# EAGLE design Irrigation Controller (EAGLE 9.5.1)
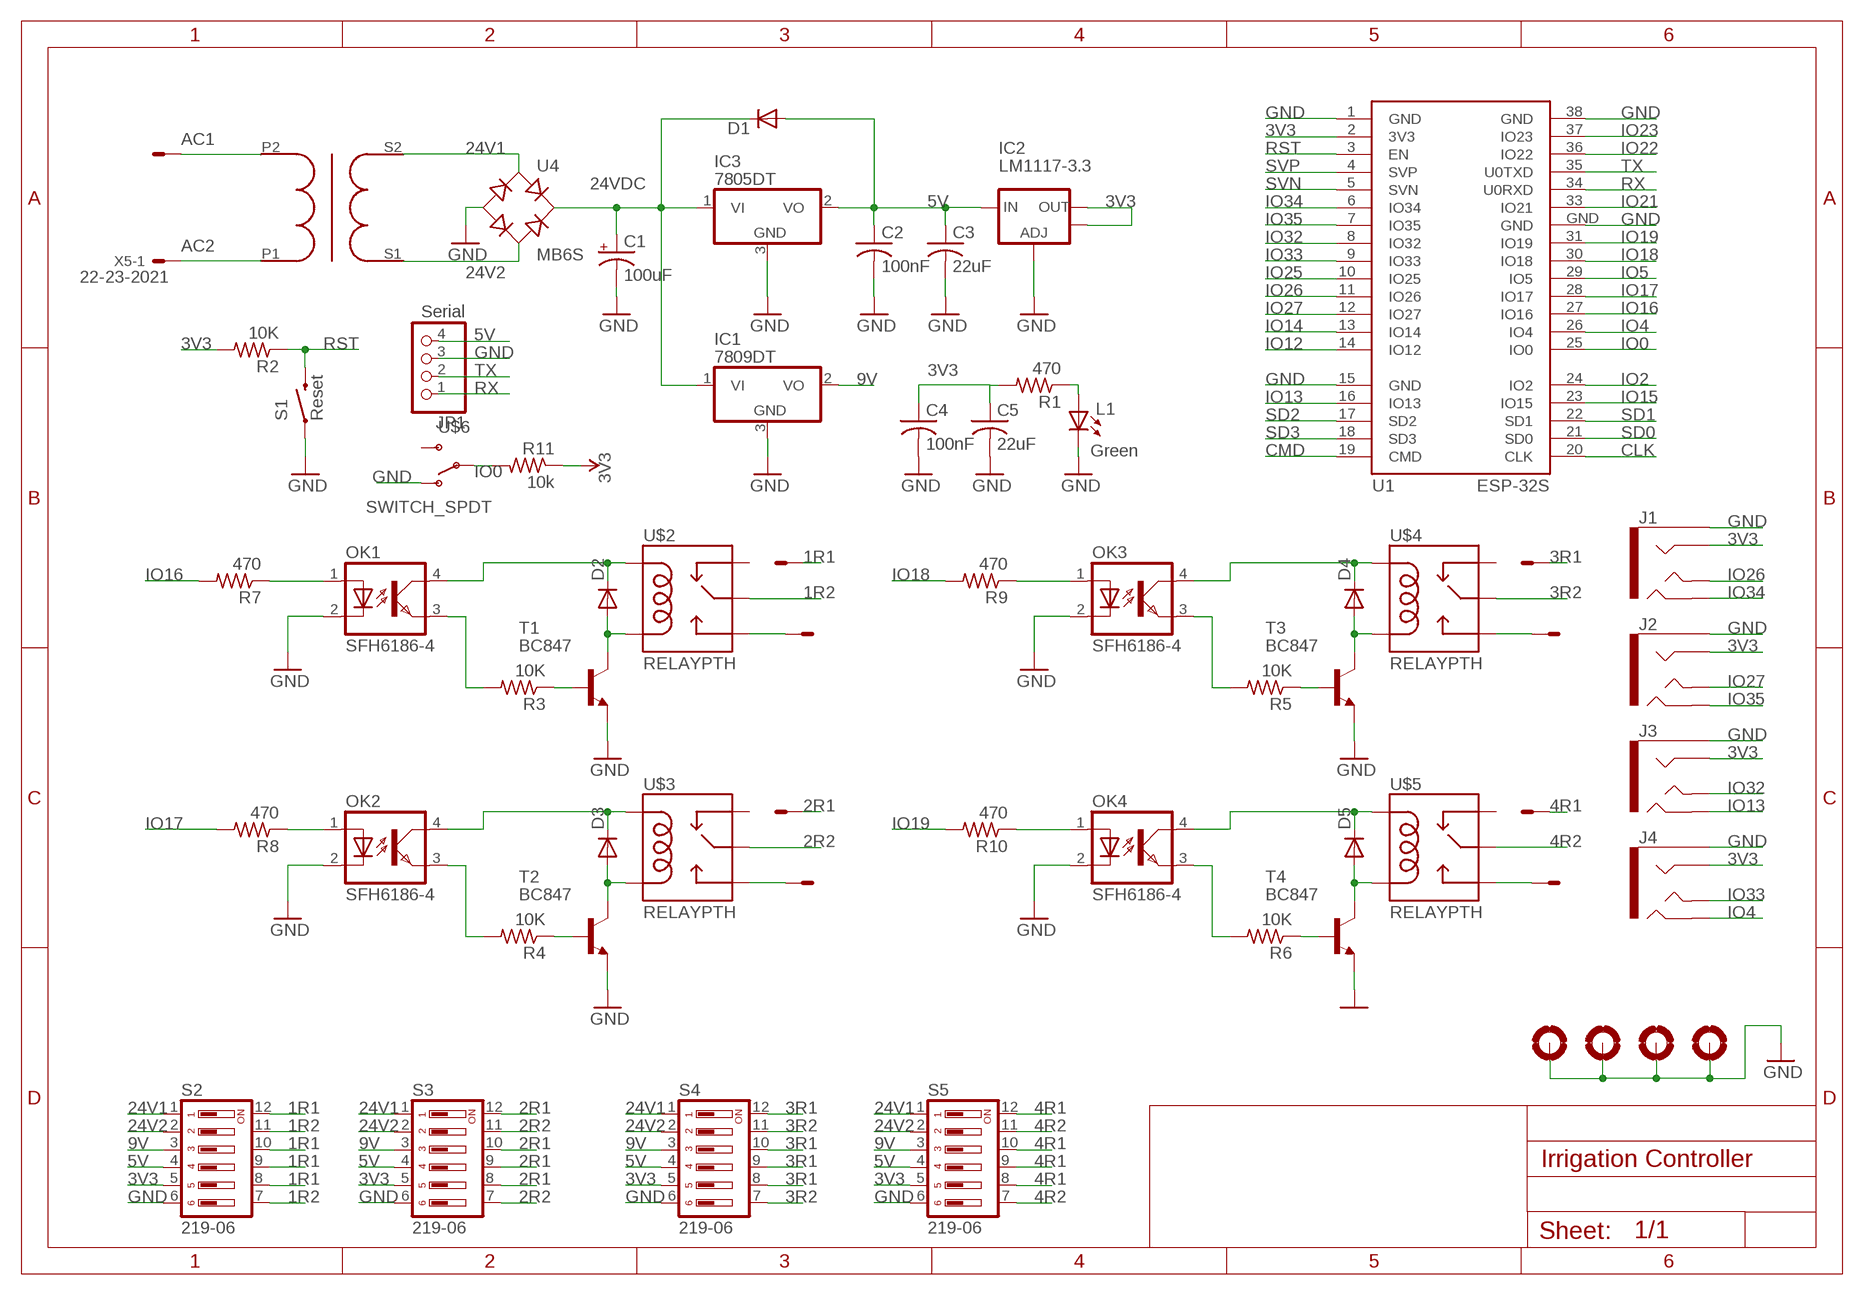
[diagram p0: schematic, sheet 1]

## Parts
C1  100uF  CPOL-USCT7343  [CT7343]
C2  100nF  C1206  [1206]
C3  22uF  C1206  [1206]
C4  100nF  C1206  [1206]
C5  22uF  C1206  [1206]
D1  DIODE-SOD123  [SOD123]
D2  DIODE-SOD123  [SOD123]
D3  DIODE-SOD123  [SOD123]
D4  DIODE-SOD123  [SOD123]
D5  DIODE-SOD123  [SOD123]
H1  MOUNT-PAD-ROUND3.0  [3,0-PAD]
H2  MOUNT-PAD-ROUND3.0  [3,0-PAD]
H3  MOUNT-PAD-ROUND3.0  [3,0-PAD]
H4  MOUNT-PAD-ROUND3.0  [3,0-PAD]
IC1  7809DT  7805DT  [TO252]
IC2  LM1117-3.3  V_REG_LM1117SOT223  [SOT223]
IC3  7805DT  [TO252]
J1  AUDIO_JACK_TRRSSMD_RA  [AUDIO_JACK_3.5MM_TRRS_SMD_RA]
J2  AUDIO_JACK_TRRSSMD_RA  [AUDIO_JACK_3.5MM_TRRS_SMD_RA]
J3  AUDIO_JACK_TRRSSMD_RA  [AUDIO_JACK_3.5MM_TRRS_SMD_RA]
J4  AUDIO_JACK_TRRSSMD_RA  [AUDIO_JACK_3.5MM_TRRS_SMD_RA]
JP1  Serial  PINHD-1X4  [1X04]
L1  Green  LED1206  [LED1206]
OK1  SFH6186-4  [SMD4-7]
OK2  SFH6186-4  [SMD4-7]
OK3  SFH6186-4  [SMD4-7]
OK4  SFH6186-4  [SMD4-7]
R1  470  R1206  [1206]
R2  10K  R-US_R1206  [R1206]
R3  10K  R-US_R1206  [R1206]
R4  10K  R-US_R1206  [R1206]
R5  10K  R-US_R1206  [R1206]
R6  10K  R-US_R1206  [R1206]
R7  470  R-US_R1206  [R1206]
R8  470  R-US_R1206  [R1206]
R9  470  R-US_R1206  [R1206]
R10  470  R-US_R1206  [R1206]
R11  10k  R1206  [1206]
S1  Reset  SWITCH-MOMENTARY-2SMD-4  [TACTILE_SWITCH_TALL]
S2  219-06  [CTS-219-06]
S3  219-06  [CTS-219-06]
S4  219-06  [CTS-219-06]
S5  219-06  [CTS-219-06]
T1  BC847  [SOT23]
T2  BC847  [SOT23]
T3  BC847  [SOT23]
T4  BC847  [SOT23]
U1  ESP-32S  [ESP-32S]
U4  MB6S  [SOIC-4]
U$1  TRANSFORMADOR_PE3010-M  [TRANSFORMADOR_PE3010-M]
U$2  RELAYPTH  [SRD-05VDC-SL-C]
U$3  RELAYPTH  [SRD-05VDC-SL-C]
U$4  RELAYPTH  [SRD-05VDC-SL-C]
U$5  RELAYPTH  [SRD-05VDC-SL-C]
U$6  SWITCH_SPDT  [KPS-1290]
X1  22-23-2021  [22-23-2021]
X2  22-23-2021  [22-23-2021]
X3  22-23-2021  [22-23-2021]
X4  22-23-2021  [22-23-2021]
X5  22-23-2021  [22-23-2021]

## Nets
1R1: S2.8 S2.9 S2.10 S2.12 X1.1
1R2: S2.7 S2.11 U$2.SWCOMMON
2R1: S3.8 S3.9 S3.10 S3.12 X2.1
2R2: S3.7 S3.11 U$3.SWCOMMON
3R1: S4.8 S4.9 S4.10 S4.12 X3.1
3R2: S4.7 S4.11 U$4.SWCOMMON
3V3: C4.1 C5.1 IC2.2(OUT) IC2.4(OUT) J1.RING1 J2.RING1 J3.RING1 J4.RING1 R1.2 R2.2 R11.1 S2.5 S3.5 S4.5 S5.5 U1.2(3V3) ; supply symbol labelled VCC
4R1: S5.8 S5.9 S5.10 S5.12 X4.1
4R2: S5.7 S5.11 U$5.SWCOMMON
5V: C2.1 C3.1 D1.A IC2.3(IN) IC3.2(VO) JP1.4 S2.4 S3.4 S4.4 S5.4
9V: IC1.2(VO) S2.3 S3.3 S4.3 S5.3
24V1: S2.1 S3.1 S4.1 S5.1 U4.~1(AC1) U$1.S2
24V2: S2.2 S3.2 S4.2 S5.2 U4.~2(AC2) U$1.S1
24VDC: C1.+ D1.C IC1.1(VI) IC3.1(VI) U4.+
AC1: U$1.P2 X5.2
AC2: U$1.P1 X5.1
CLK: U1.20(CLK)
CMD: U1.19(CMD)
GND: C1.- C2.2 C3.2 C4.2 C5.2 H1.B3,0(MOUNT) H2.B3,0(MOUNT) H3.B3,0(MOUNT) H4.B3,0(MOUNT) IC1.3(GND) IC2.1(ADJ) IC3.3(GND) J1.EARTH J2.EARTH J3.EARTH J4.EARTH JP1.3 L1.C OK1.2(C) OK2.2(C) OK3.2(C) OK4.2(C) S1.A2 S2.6 S3.6 S4.6 S5.6 T1.2(E) T2.2(E) T3.2(E) T4.2(E) U1.1(GND) U1.15(GND) U1.38(GND) U1.GND U4.- U$6.O
IO0: R11.2 U1.25(IO0) U$6.P
IO2: U1.24(IO2)
IO4: J4.RING2 U1.26(IO4)
IO5: U1.29(IO5)
IO12: U1.14(IO12)
IO13: J3.RING2 U1.16(IO13)
IO14: U1.13(IO14)
IO15: U1.23(IO15)
IO16: R7.2 U1.27(IO16)
IO17: R8.2 U1.28(IO17)
IO18: R9.2 U1.30(IO18)
IO19: R10.2 U1.31(IO19)
IO21: U1.33(IO21)
IO22: U1.36(IO22)
IO23: U1.37(IO23)
IO25: U1.10(IO25)
IO26: J1.TIP U1.11(IO26)
IO27: J2.TIP U1.12(IO27)
IO32: J3.TIP U1.8(IO32)
IO33: J4.TIP U1.9(IO33)
IO34: J1.RING2 U1.6(IO34)
IO35: J2.RING2 U1.7(IO35)
N$1: U$5.SWOPEN X4.2
N$2: U$4.SWOPEN X3.2
N$3: L1.A R1.1
N$4: U$3.SWOPEN X2.2
N$5: U$2.SWOPEN X1.2
N$6: D2.C OK1.4(COL) U$2.COIL1
N$7: D2.A T1.3(C) U$2.COIL0
N$8: OK1.3(EMIT) R3.2
N$9: R3.1 T1.1(B)
N$10: D3.C OK2.4(COL) U$3.COIL1
N$11: D3.A T2.3(C) U$3.COIL0
N$12: OK2.3(EMIT) R4.2
N$13: R4.1 T2.1(B)
N$14: D4.C OK3.4(COL) U$4.COIL1
N$15: D4.A T3.3(C) U$4.COIL0
N$16: OK3.3(EMIT) R5.2
N$17: R5.1 T3.1(B)
N$18: D5.C OK4.4(COL) U$5.COIL1
N$19: D5.A T4.3(C) U$5.COIL0
N$20: OK4.3(EMIT) R6.2
N$21: R6.1 T4.1(B)
N$22: OK1.1(A) R7.1
N$25: OK2.1(A) R8.1
N$27: OK3.1(A) R9.1
N$29: OK4.1(A) R10.1
RST: R2.1 S1.B2 U1.3(EN)
RX: JP1.1 U1.34(U0RXD)
SD0: U1.21(SD0)
SD1: U1.22(SD1)
SD2: U1.17(SD2)
SD3: U1.18(SD3)
SVN: U1.5(SVN)
SVP: U1.4(SVP)
TX: JP1.2 U1.35(U0TXD)
Unconnected: U$2.SWCLOSED(SWCLOSE) U$3.SWCLOSED(SWCLOSE) U$4.SWCLOSED(SWCLOSE) U$5.SWCLOSED(SWCLOSE) U$6.S

## Library data of the parts
C1 = resistor:CPOL-US: POLARIZED CAPACITOR, American symbol
C2-C5 = SpaceDIY_passive_components:C1206
D1-D5 = diode:DIODE-: DIODE
H1-H4 = holes:MOUNT-PAD-ROUND: MOUNTING PAD, round
IC1 IC3 = linear:78*: Positive VOLTAGE REGULATOR Source: http://cache.national.com/ds/LM/LM78L05.pdf http://www.fairchildsemi.com/ds/LM/LM7805.pdf
IC2 = SparkFun:V_REG_LM1117: Voltage Regulator LM1117 Standard adjustable voltage regulator but in SMD form. Spark Fun Electronics SKU : COM-00595
J1-J4 = SparkFun-Connectors:AUDIO_JACK_TRRS: Audio Jack - 3.5mm TRRS (SMD) This is a 3.5mm TRRS SMD audio jack. TRRS connectors are the audio-style connectors that you see on some phones, MP3 players and development boards. TRRS stands for “tip, ring, ring, sleeve,” which reflects that this has three conductors and a ground. SparkFun Products: Audio Jack <https://www.sparkfun.com/products/12639> mbed Starter Kit <https://www.sparkfun.com/products/12968> SparkFun TRRS 3.5mm Jack Breakout <https://www.sparkfun.com/products/11570>; PROD_ID: CONN-10676; SF_ID: PRT-12639
JP1 = SpaceDIY_connectors:PINHD-1X4: PIN HEADER
L1 = SpaceDIY_passive_components:LED1206
OK1-OK4 = optocoupler:SFH618?*: Optocoupler, Phototransistor Output, Low Input Current Source: Data sheet <http://www.vishay.com/docs/83673/sfh618.pdf>; MF: VISHAY/TELEFUNKEN; MPN: SFH6186-4; OC_FARNELL: 1469530; OC_NEWARK: 21H7753
R1 R11 = SpaceDIY_passive_components:R1206
R2-R10 = resistor:R-US_: RESISTOR, American symbol
S1 = Testing:SWITCH-MOMENTARY-2: Various NO switches- pushbuttons, reed, etc
S2-S5 = switch-dil:219-06*: Surface Mount DIP Switch Series 219 SMT CTS Electronic Components Sourc: www.ctscorp.com; OC_FARNELL: unknown; OC_NEWARK: unknown
T1-T4 = transistor:BC847: NPN TRANSISTOR
U1 = esp32:ESP-32S: Ai-Thinker ESP-32S
U4 = rectifier:MB*S: Bridge Rectifier Source: http://www.fairchildsemi.com/ds/MB/MB6S.pdf
U$1 = SpaceDIY_special_components:TRANSFORMADOR_PE3010-M
U$2-U$5 = SpaceDIY_actuators:RELAY: SPDT relay (COM-00101)
U$6 = SparkFun-Retired:SWITCH_SPDT: SWCH-10651 Side-actuated SPDT slide switch, as used on the Arduino Pro; PROD_ID: SWCH-10651
X1-X5 = con-molex:22-23-2021: .100" (2.54mm) Center Header - 2 Pin; MF: MOLEX; MPN: 22-23-2021; OC_FARNELL: 1462926; OC_NEWARK: 25C3832

## Board
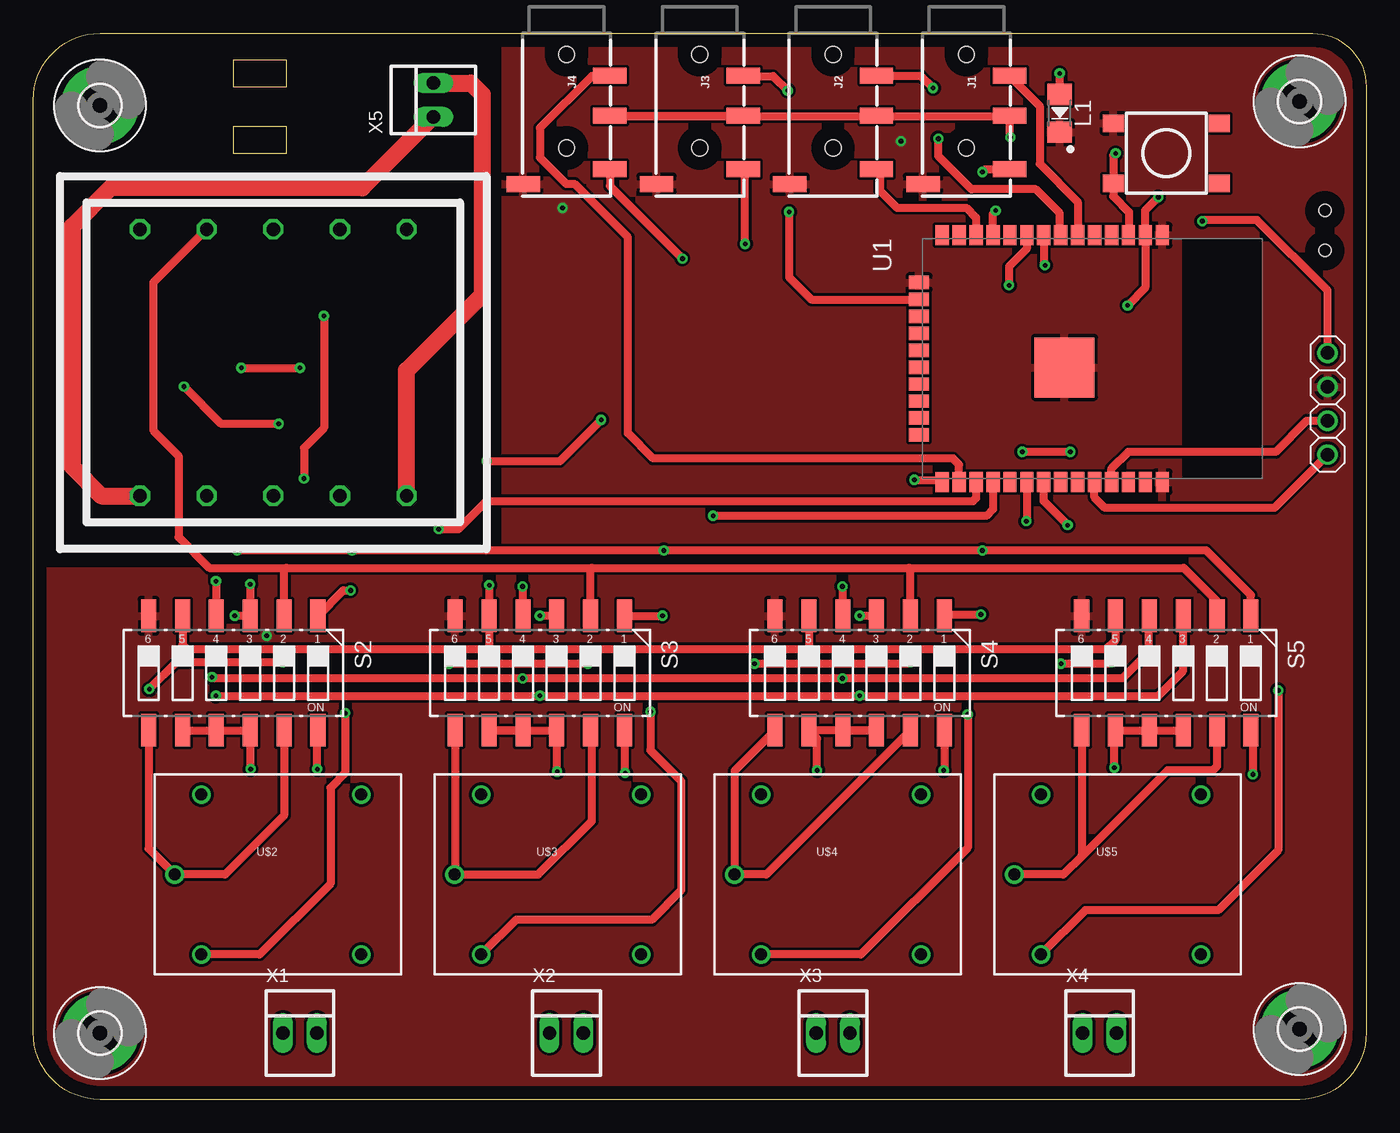
[diagram p1: board, top side]
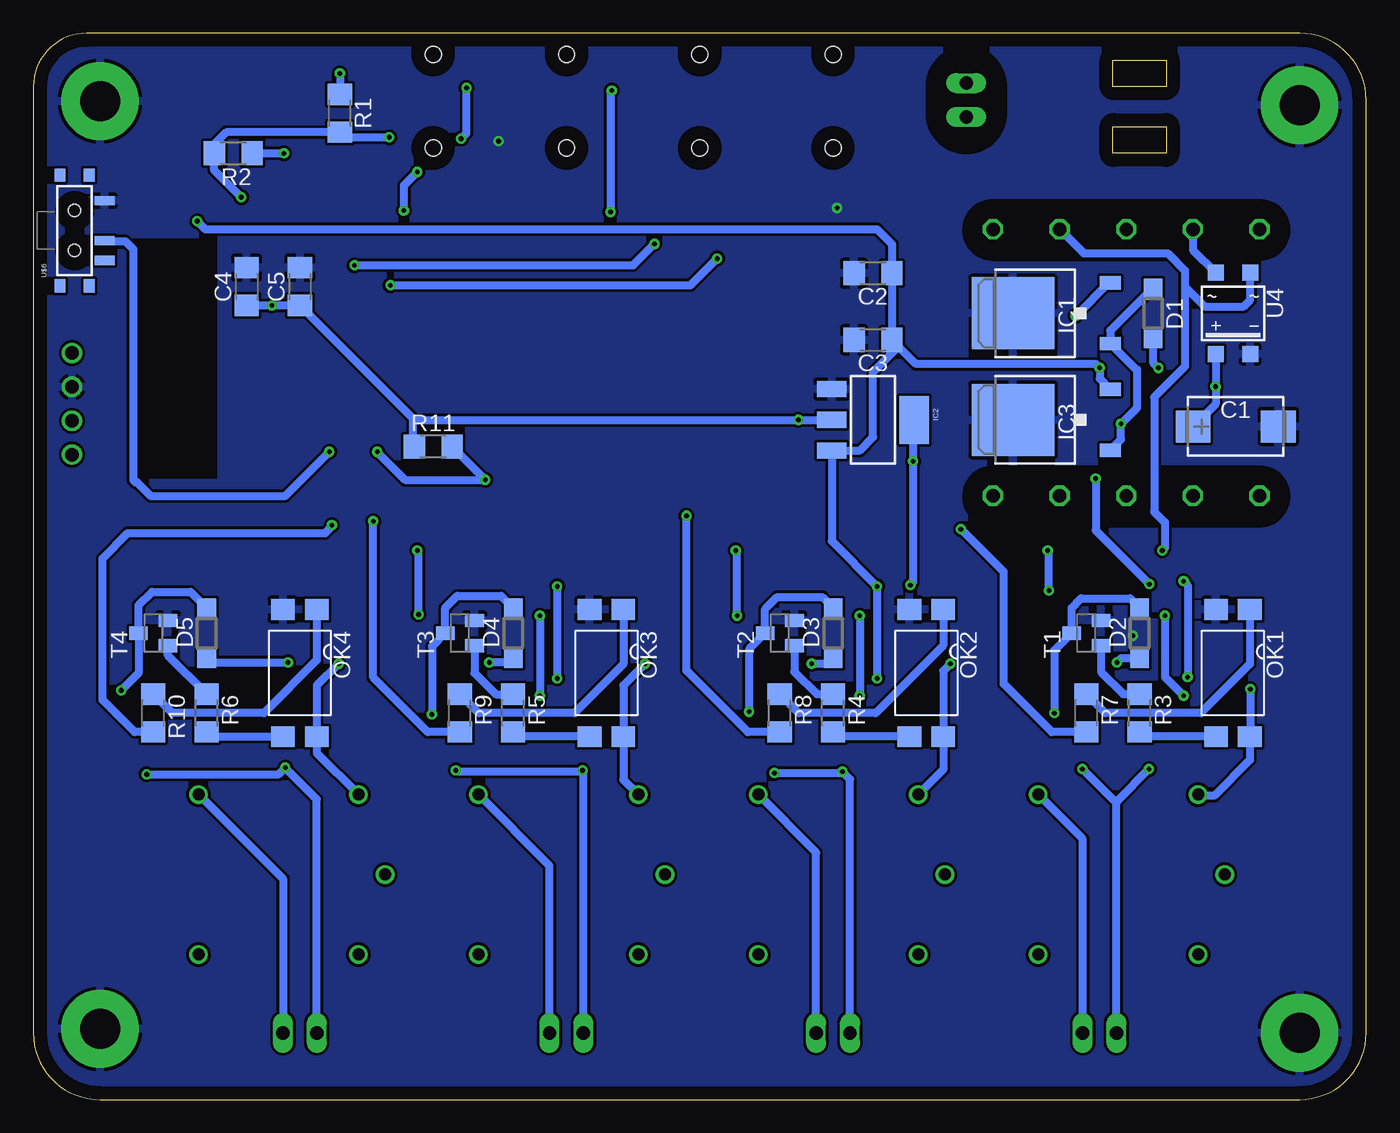
[diagram p2: board, bottom side, seen from below]

Size 100 x 80 mm. Coordinates in mm from the lower left corner, seen from the top.
Outline: 0,5 0,75 arc-90 5,80 96,80 arc-90 100,76 100,5 arc-90 95,0 5,0 arc-90 0,5
Outline: 19,78 15,78 15,76 19,76 19,78
Outline: 15,73 15,71 19,71 19,73 15,73
Copper layers (1*16): Top 0.035mm / dielectric 1.5mm / Bottom 0.035mm
Design rules "PCBway": minimum track width 6mil, minimum drill 0.3mm, track to track 0.205mm, track to pad 0.205mm, pad to pad 0.205mm, via to via 0.205mm, smd to smd 8mil, copper to edge 40mil, drill to drill 8mil, minimum pad ring 10mil, minimum via ring 8mil, stop-mask expansion 4mil, vias tented up to drill 25mil, thermal gap 10mil
tRestrict: area 0,40 to 35,80
bRestrict: area 27,71 to 33,79; area 5.8,63 to 30.2,67.5; area 5.8,43 to 30.2,47.5

### Footprints (pad centres in the part's own frame; a part is rotated, then mirrored left to right if it is on the bottom)
CT7343 = smd 2.6 x 2.4: + 3.2,0; - -3.2,0
1206 = smd 1.6 x 1.803: 1 -1.422,0; 2 1.422,0
SOD123 = smd 1.4 x 1.4: A 1.9,0; C -1.9,0
3,0-PAD = drill 3 pad 5.842: B3,0 0,0
TO252 = smd 1 x 1.6: 1 -2.28,-4.8; 2 2.28,-4.8 | smd 5.4 x 6.2: 3 0,2.5
SOT223 = smd 1.219 x 2.235: 1 -2.311,-3.099; 2 0,-3.099; 3 2.311,-3.099 | smd 3.6 x 2.2: 4 0,3.099
AUDIO_JACK_3.5MM_TRRS_SMD_RA = smd 1.2 x 2.5: EARTH 11.3,-3.25; RING1 6.2,3.25; RING2 3.2,3.25; TIP 10.2,3.25 | hole 1.2: 1.6,0; 8.6,0
1X04 = drill 1.016: 1 -3.81,0; 2 -1.27,0; 3 1.27,0; 4 3.81,0
LED1206 = smd 1.6 x 1.803: A -1.422,0; C 1.422,0
SMD4-7 = smd 1.78 x 1.55: 1 -1.27,-4.77; 2 1.27,-4.77; 3 1.27,4.77; 4 -1.27,4.77
R1206 = smd 1.6 x 1.803: 1 -1.422,0; 2 1.422,0
TACTILE_SWITCH_TALL = smd 1.55 x 1.3: A1 -3.975,-2.25; A2 3.975,-2.25; B1 -3.975,2.25; B2 3.975,2.25
CTS-219-06 = smd 1.13 x 2.44: 1 -6.35,-4.3; 2 -3.81,-4.3; 3 -1.27,-4.3; 4 1.27,-4.3; 5 3.81,-4.3; 6 6.35,-4.3; 7 6.35,4.3; 8 3.81,4.3; 9 1.27,4.3; 10 -1.27,4.3; 11 -3.81,4.3; 12 -6.35,4.3
SOT23 = smd 1 x 1.4: 1 -0.95,-1.1; 2 0.95,-1.1; 3 0,1.1
ESP-32S = smd 1.5 x 1: 1 -9.25,7; 2 -9.25,5.73; 3 -9.25,4.46; 4 -9.25,3.19; 5 -9.25,1.92; 6 -9.25,0.65; 7 -9.25,-0.62; 8 -9.25,-1.89; 9 -9.25,-3.16; 10 -9.25,-4.43; 11 -9.25,-5.7; 12 -9.25,-6.97; 13 -9.25,-8.24; 14 -9.25,-9.51; 25 9.25,-9.51; 26 9.25,-8.24; 27 9.25,-6.97; 28 9.25,-5.7; 29 9.25,-4.43; 30 9.25,-3.16; 31 9.25,-1.89; 32 9.25,-0.62; 33 9.25,0.65; 34 9.25,1.92; 35 9.25,3.19; 36 9.25,4.46; 37 9.25,5.73; 38 9.25,7 | smd 1 x 1.5: 15 -5.7,-11.25; 16 -4.43,-11.25; 17 -3.16,-11.25; 18 -1.89,-11.25; 19 -0.62,-11.25; 20 0.65,-11.25; 21 1.92,-11.25; 22 3.19,-11.25; 23 4.46,-11.25; 24 5.73,-11.25 | smd 4.5 x 4.5: GND 0.68,-0.33
SOIC-4 = smd 1.2 x 1.2: + 1.3,3.05; - -1.3,3.05; ~1 -1.3,-3.05; ~2 1.3,-3.05
TRANSFORMADOR_PE3010-M = drill 1 octagon: P1 -10,-10; P2 10,-10; P$3 10,10; P$6 -10,10; P$7 0,10; P$8 -5,-10; P$9 0,-10; P$10 5,-10; S1 -5,10; S2 5,10
SRD-05VDC-SL-C = drill 0.9: COIL0 -5.39,-6.12; COIL1 -5.39,5.88; SWCLOSED 6.61,-6.12; SWCOMMON -7.39,-0.12; SWOPEN 6.61,5.88
KPS-1290 = smd 0.7 x 1.5: O -2.25,2.25; P 0.75,2.25; S 2.25,2.25 | smd 1 x 0.8: P$1 -4.15,1.1; P$2 -4.15,-1.1; P$3 4.15,-1.1; P$4 4.15,1.1 | hole 0.9: -1.5,0; 1.5,0
22-23-2021 = drill 1 long: 1 -1.27,0; 2 1.27,0

### Placement (x,y rotation side)
C1  9.8,50.5 180 bottom
C2  37,62 180 bottom
C3  37,57 180 bottom
C4  84,61 90 bottom
C5  80,61 90 bottom
D1  16,59 270 bottom
D2  17,35 90 bottom
D3  40,35 90 bottom
D4  64,35 90 bottom
D5  87,35 90 bottom
H1  5,5 0 top
H2  95,5.3 0 top
H3  5,74.6 0 top
H4  95,74.9 0 top
IC1  24,59 90 bottom
IC2  37,51 270 bottom
IC3  24,51 90 bottom
J1  70,80 270 top
J2  60,80 270 top
J3  50,80 270 top
J4  40,80 270 top
JP1  97.1,52.2 90 top
L1  77,74 270 top
OK1  10,32 180 bottom
OK2  33,32 180 bottom
OK3  57,32 180 bottom
OK4  80,32 180 bottom
R1  77,74 270 bottom
R2  85,71 180 bottom
R3  17,29 270 bottom
R4  40,29 270 bottom
R5  64,29 270 bottom
R6  87,29 270 bottom
R7  21,29 270 bottom
R8  44,29 270 bottom
R9  68,29 270 bottom
R10  91,29 270 bottom
R11  70,49 0 bottom
S1  85,71 180 top
S2  15,32 180 top
S3  38,32 180 top
S4  62,32 180 top
S5  85,32 180 top
T1  21,35 90 bottom
T2  44,35 90 bottom
T3  68,35 90 bottom
T4  91,35 90 bottom
U1  77.7,55.6 270 top
U4  10,59 180 bottom
U$1  18,55.3 0 top
U$2  18,17 0 top
U$3  39,17 0 top
U$4  60,17 0 top
U$5  81,17 0 top
U$6  96.9,65.2 270 bottom
X1  20,5 0 top
X2  40,5 0 top
X3  60,5 0 top
X4  80,5 0 top
X5  30,75 90 top

### Tracks (layer width: path | path; a pad name or v marks a point on that pad's centre or on a via)
1R1  (via drill 0.35)
  Top 0.61: S2.8 S2.9 S2.10 16.27,24.83 v16.3,24.8 | v21.3,24.8 21.3,27.65 S2.12
  Bottom 0.61: X1.1 18.73,22.23 18.95,22.45 | 18.95,22.45 v21.3,24.8 | v16.3,24.8 18.65,22.45 18.95,22.45
1R2
  Top 0.61: S2.7 8.65,18.84 U$2.SWCOMMON 14.38,16.88 18.81,21.31 S2.11
2R1  (via drill 0.35)
  Top 0.61: v39.3,24.6 39.3,27.67 S3.10 S3.8 S3.9 | S3.12 44.35,24.55 v44.4,24.5
  Bottom 0.61: X2.1 38.73,24.03 v39.3,24.6 39.4,24.5 v44.4,24.5
2R2
  Top 0.61: S3.7 31.65,16.92 U$3.SWCOMMON 37.88,16.88 41.9,20.9 41.9,27.61 S3.11
3R1  (via drill 0.35)
  Top 0.61: v58.8,24.7 58.8,27.09 S4.8 S4.10 S4.9 | S4.12 68.35,24.75 v68.3,24.7
  Bottom 0.61: X3.1 58.73,24.63 | 58.73,24.63 v58.8,24.7 | v68.3,24.7 68.23,24.63 58.73,24.63
3R2
  Top 0.61: S4.11 54.99,16.88 U$4.SWCOMMON 52.61,24.66 S4.7
3V3  (via drill 0.35)
  Top 0.61: v34,47.9 39.5,47.9 v42.6,51 | v82.1,59.58 83.43,60.91 U1.2 83.43,66.73 v84.4,67.7 | v73.3,72.2 73.25,72.25 73.25,73.7 | 73.25,73.7 J1.RING1 | 73.25,73.7 73.15,73.8 J2.RING1 J4.RING1 J3.RING1 | S2.5 11.19,34.11 11.5,33.8 34.2,33.8 | 34.2,33.8 58.3,33.8 | 58.3,33.8 80.5,33.8 81.2,34.5 S5.5 | S4.5 58.19,33.91 58.3,33.8 | 34.2,33.8 34.19,33.81 S3.5 v34.2,38.6
  Bottom 0.61: IC2.4 34,50.9 v34,47.9 34,38.8 v34.2,38.6 | IC2.2 v42.6,51 71.5,51 | R11.1 71.5,49.08 71.5,51 | C4.1 v82.1,59.58 C5.1 71.5,51.08 71.5,51 | v84.4,67.7 86.42,69.72 R2.2 86.42,71.68 85.52,72.58 R1.2 76.62,72.2 v73.3,72.2
4R1  (via drill 0.35)
  Top 0.61: v81.1,24.9 81.1,27.61 S5.8 S5.10 S5.9 | S5.12 91.5,27.55 v91.5,24.4
  Bottom 0.61: X4.1 78.73,22.53 v81.1,24.9 81.6,24.4 v91.5,24.4
4R2
  Top 0.61: S5.11 88.81,25.01 88.5,24.7 85.1,24.7 78.7,18.3 | 78.7,18.3 77.28,16.88 U$5.SWCOMMON | S5.7 78.65,18.35 78.7,18.3
5V  (via drill 0.35)
  Top 0.61: v15.6,54.9 v20,54.9 | JP1.4 97.1,60.7 91.8,66 87.8,66 v87.7,65.9 | S3.4 36.73,38.47 v36.7,38.5 | v13.4,31.7 13.5,31.6 27.7,31.6 v36.7,31.6 v60.7,31.6 81.7,31.6 83.7,33.6 83.7,36.8 83.5,37 83.5,36.53 S5.4 | v13.7,38.9 13.73,38.87 S2.4 | S4.4 60.73,38.47 v60.7,38.5
  Bottom 0.61: D1.A 16,55.3 v15.6,54.9 | IC3.2 20,54.08 v20,54.9 20.3,55.2 33.78,55.2 35.09,56.51 | 35.09,56.51 C3.1 C2.1 35.58,64.18 36.7,65.3 87.1,65.3 v87.7,65.9 | 35.09,56.51 37,54.6 37,49.7 38,48.7 40.09,48.7 IC2.3 40.1,41.9 v36.7,38.5 v36.7,31.6 | v13.7,38.9 13.4,38.6 v13.4,31.7 | v60.7,38.5 v60.7,31.6
9V  (via drill 0.35)
  Top 0.61: v15.1,36.3 S2.3 v16.27,38.67 | v13.7,30.3 v38,30.3 v62,30.3 84.4,30.3 86.27,32.17 S5.3 | S4.3 v62,36.3 | S3.3 v38,36.3 | v21.8,58.8 21.8,50.4 20.3,48.9 v20.3,46.6
  Bottom 0.61: v15.1,36.3 15.1,31.7 v13.7,30.3 | v62,36.3 v62,30.3 | v38,36.3 v38,30.3 | IC1.2 19.32,61.28 v21.8,58.8 | v20.3,46.6 20.3,42.7 v16.27,38.67
24V1  (via drill 0.35)
  Top 0.61: S5.1 91.35,37.85 88,41.2 v71.2,41.2 v47.3,41.2 v23.9,41.2 v15.3,41.2 | S2.1 23.25,38.2 v23.8,38.2 | S3.1 v47.2,36.3 | S4.1 68.45,36.4 v71.1,36.4
  Bottom 0.61: U$1.S2 21.2,63.5 14.9,63.5 13.6,62.2 13.6,61 | 13.6,61 12.1,59.5 9.2,59.5 8.7,60 U4.~1 | 13.6,61 13.6,55 15.9,52.7 15.9,44.1 15.1,43.3 15.1,41.4 v15.3,41.2 | v23.8,38.2 23.8,41.1 v23.9,41.2 | v47.2,36.3 47.2,41.1 v47.3,41.2 | v71.1,36.4 71.1,41.1 v71.2,41.2
24V2
  Top 0.61: U$1.S1 9,61.3 9,50.2 10.9,48.3 10.9,42.2 13.2,39.9 19,39.9 | 19,39.9 41.9,39.9 | 41.9,39.9 65.7,39.9 | 65.7,39.9 86.3,39.9 88.81,37.39 S5.2 | S2.2 18.81,39.71 19,39.9 | S3.2 41.81,39.81 41.9,39.9 | S4.2 65.81,39.79 65.7,39.9
  Bottom 0.61: U$1.S1 13,63.75 U4.~2
24VDC  (via drill 0.35)
  Top 0.61: v18.4,50.7 14.1,50.7 v11.3,53.5
  Bottom 0.61: U4.+ v11.3,53.5 11.3,52.2 C1.+ | IC3.1 18.4,49.52 v18.4,50.7 17.2,51.9 17.2,54.8 17.28,54.8 IC1.1 19.2,57.7 D1.C
AC1
  Top 1.27: X5.2 32.83,76.27 33.7,75.4 33.7,60.4 28,54.7 U$1.P2
AC2
  Top 1.27: X5.1 24.67,68.4 5.8,68.4 2.9,65.5 2.9,47.5 5.1,45.3 U$1.P1
GND  (via drill 0.35)
  other vias: 39.7,66.9 17.5,34.8 65.1,71.9
  pour Top: 0,75 arc-90 5,80 95,80 arc-90 100,75 100,5 arc-90 95,0 5,0 arc-90 0,5
  pour Bottom: 0,75 arc-90 5,80 95,80 arc-90 100,75 100,5 arc-90 95,0 5,0 arc-90 0,5
IO0  (via drill 0.35)
  Top 0.61: v66.1,46.5 68.04,46.5 U1.25 | v77.8,48.6 v74.2,48.6
  Bottom 0.61: R11.2 66.1,46.52 v66.1,46.5 72.1,46.5 v74.2,48.6 | U$6.P 94.6,64.4 93.1,64.4 92.5,63.8 92.5,46.47 92.33,46.3 92.19,46.3 91.2,45.3 81.1,45.3 v77.8,48.6
IO4
  Top 0.61: U1.26 69.46,47.64 69,48.1 46.5,48.1 44.6,50 44.6,64.7 40.6,68.7 39.98,68.7 38,70.68 38,72.9 41.9,76.8 J4.RING2
IO13  (via drill 0.35)
  Top 0.61: J3.RING2 55.5,76.8 v56.6,75.7 | v56.7,66.6 56.7,61.7 58.37,60.03 U1.16
  Bottom 0.61: v56.6,75.7 56.7,75.6 v56.7,66.6
IO16  (via drill 0.35)
  Top 0.61: U1.27 70.73,45.13 70.5,44.9 34,44.9 31.9,42.8 v30.4,42.8
  Bottom 0.61: R7.2 23.6,27.58 27.2,31.18 27.2,39.6 v30.4,42.8
IO17  (via drill 0.35)
  Top 0.61: U1.28 72,44.3 71.5,43.8 v51,43.8
  Bottom 0.61: R8.2 46.4,27.58 51,32.18 v51,43.8
IO18  (via drill 0.35)
  Top 0.61: U1.30 74.54,43.44 v74.5,43.4
  Bottom 0.61: R9.2 70.4,27.58 74.5,31.68 v74.5,43.4
IO19  (via drill 0.35)
  Top 0.61: v77.6,43.1 75.81,44.89 U1.31
  Bottom 0.61: v77.6,43.1 77.5,43.1 78.1,42.5 92.9,42.5 94.8,40.6 94.8,29.98 92.4,27.58 R10.2
IO26  (via drill 0.35)
  Top 0.61: U1.11 72,66.5 v72.2,66.7 | v71.2,69.6 71.4,69.8 J1.TIP
  Bottom 0.61: v72.2,66.7 72.2,68.6 v71.2,69.6
IO27
  Top 0.61: J2.TIP 63.5,69.55 63.5,68.2 64.8,66.9 70,66.9 70.73,66.17 U1.12
IO32  (via drill 0.35)
  Top 0.61: U1.8 75.81,62.69 v75.9,62.6 | v53.4,64.2 53.4,69.65 J3.TIP
  Bottom 0.61: v75.9,62.6 55,62.6 v53.4,64.2
IO33  (via drill 0.35)
  Top 0.61: J4.TIP 43.25,68.55 v48.7,63.1 | U1.9 74.54,63.84 73.2,62.5 v73.2,61.1
  Bottom 0.61: v73.2,61.1 50.7,61.1 v48.7,63.1
IO34
  Top 0.61: J1.RING2 75.5,74.55 75.5,70.2 78.35,67.35 U1.6
IO35  (via drill 0.35)
  Top 0.61: U1.7 77,64.93 77,66.5 75.2,68.3 70.38,68.3 67.9,70.78 v67.9,72.1 | v67.5,75.9 66.6,76.8 J2.RING2
  Bottom 0.61: v67.9,72.1 67.5,72.5 v67.5,75.9
N$1
  Bottom 0.61: U$5.SWOPEN 81.27,16.54 X4.2
N$2
  Bottom 0.61: X3.2 61.27,17.54 U$4.SWOPEN
N$3  (via drill 0.35)
  Top 0.61: L1.A v77,77
  Bottom 0.61: v77,77 L1.A
N$4
  Bottom 0.61: X2.2 41.27,18.54 U$3.SWOPEN
N$5
  Bottom 0.61: X1.2 21.27,19.54 U$2.SWOPEN
N$6  (via drill 0.35)
  Top 0.61: v18.7,32.8 10.7,32.8 v8.7,30.8
  Bottom 0.61: D2.C 18.4,33.1 v18.7,32.8 | v8.7,30.8 8.7,27.26 OK1.4 8.73,25.47 11.4,22.8 12.53,22.8 U$2.COIL1
N$7  (via drill 0.35)
  Top 0.61: v23.4,29 23.4,24.5 22.3,23.4 22.3,16.2 16.98,10.88 U$2.COIL0
  Bottom 0.61: D2.A 17.7,37.6 21.4,37.6 22.1,36.9 T1.3 23.4,33.7 v23.4,29
N$8
  Bottom 0.61: OK1.3 16.65,27.23 R3.2
N$9
  Bottom 0.61: T1.1 19.9,32.1 18.22,30.42 R3.1
N$10  (via drill 0.35)
  Top 0.61: v41.6,32.7 v31.2,32.7
  Bottom 0.61: D3.C 40.4,32.7 v41.6,32.7 | v31.2,32.7 31.73,32.17 OK2.4 31.73,24.76 U$3.COIL1
N$11  (via drill 0.35)
  Top 0.61: v46.3,29.1 46.3,26.2 48.6,23.9 48.6,15.7 46.4,13.5 36.23,13.5 U$3.COIL0
  Bottom 0.61: D3.A 40.8,37.7 44.2,37.7 45.1,36.8 T2.3 46.3,33.8 v46.3,29.1
N$12
  Bottom 0.61: OK2.3 39.65,27.23 R4.2
N$13
  Bottom 0.61: T2.1 42.9,32.1 41.22,30.42 R4.1
N$14  (via drill 0.35)
  Top 0.61: v65.8,32.8 65.7,32.7 v54.1,32.7
  Bottom 0.61: U$4.COIL1 55.73,24 OK3.4 55.73,31.07 v54.1,32.7 | D4.C 64.3,32.8 v65.8,32.8
N$15  (via drill 0.35)
  Top 0.61: v70.1,28.9 70.1,18.9 62.08,10.88 U$4.COIL0
  Bottom 0.61: D4.A 64.9,37.8 68.2,37.8 69.1,36.9 T3.3 70.1,34 v70.1,28.9
N$16
  Bottom 0.61: OK3.3 63.65,27.23 R5.2
N$17
  Bottom 0.61: T3.1 66.9,32 65.3,30.4 63.5,30.4 63.52,30.42 R5.1
N$18  (via drill 0.35)
  Top 0.61: v80.9,32.8 80.8,32.7 v77.1,32.7
  Bottom 0.61: D5.C 86.7,32.8 v80.9,32.8 | v77.1,32.7 78.73,31.07 OK4.4 78.73,26 U$5.COIL1
N$19  (via drill 0.35)
  Top 0.61: v93.4,30.7 93.4,18.7 88.9,14.2 78.93,14.2 U$5.COIL0
  Bottom 0.61: D5.A 88.2,38.1 91.1,38.1 92.1,37.1 T4.3 92.1,32 v93.4,30.7
N$20
  Bottom 0.61: R6.2 86.65,27.23 OK4.3
N$21
  Bottom 0.61: R6.1 89.9,33.32 T4.1
N$22
  Bottom 0.61: OK1.1 8.73,32.67 12.4,29 19.58,29 R7.1
N$25
  Bottom 0.61: OK2.1 31.73,34.07 36.8,29 42.58,29 R8.1
N$27
  Bottom 0.61: OK3.1 55.73,32.67 59.4,29 66.58,29 R9.1
N$29
  Bottom 0.61: OK4.1 78.73,32.97 82.7,29 89.58,29 R10.1
RST  (via drill 0.35)
  Top 0.61: v81.2,71 81.03,70.83 S1.B2 81.03,67.78 82.2,66.6 82.2,64.89 U1.3
  Bottom 0.61: R2.1 v81.2,71
RX
  Top 0.61: JP1.1 93.11,44.4 80.4,44.4 79.62,45.18 U1.34
TX
  Top 0.61: U1.35 80.89,47.35 82.14,48.6 93.2,48.6 95.53,50.93 JP1.2